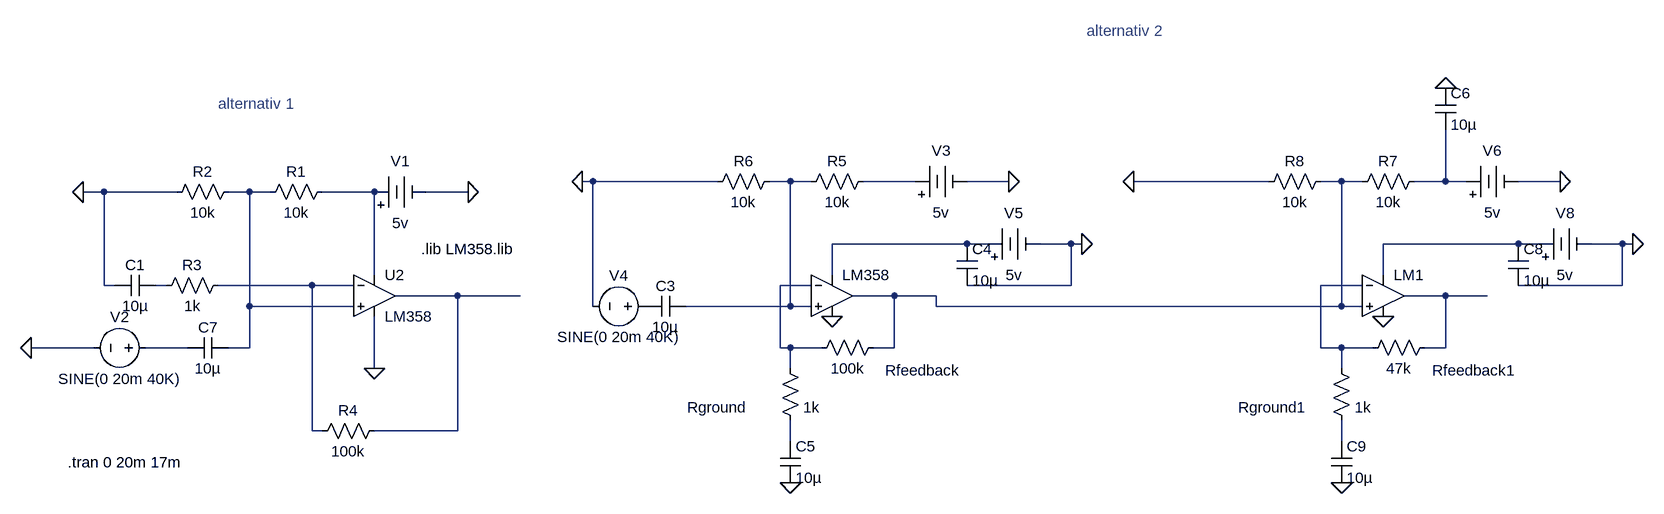
[diagram p0: schematic vilopunkt_LM358.asc]
vilopunkt_LM358.asc, the LTspice schematic file:
Version 4
SHEET 1 2372 680
WIRE 752 -288 736 -288
WIRE 944 -288 752 -288
WIRE 1056 -288 1024 -288
WIRE 1088 -288 1056 -288
WIRE 1248 -288 1168 -288
WIRE 1392 -288 1328 -288
WIRE 1792 -288 1584 -288
WIRE 1904 -288 1872 -288
WIRE 1936 -288 1904 -288
WIRE 2064 -288 2064 -368
WIRE 2064 -288 2016 -288
WIRE 2096 -288 2064 -288
WIRE 2240 -288 2176 -288
WIRE 0 -272 -32 -272
WIRE 112 -272 0 -272
WIRE 224 -272 192 -272
WIRE 256 -272 224 -272
WIRE 416 -272 336 -272
WIRE 560 -272 496 -272
WIRE 1328 -192 1120 -192
WIRE 1360 -192 1328 -192
WIRE 1488 -192 1440 -192
WIRE 1504 -192 1488 -192
WIRE 2176 -192 1968 -192
WIRE 2208 -192 2176 -192
WIRE 2336 -192 2288 -192
WIRE 2352 -192 2336 -192
WIRE 416 -144 416 -272
WIRE 1120 -144 1120 -192
WIRE 1968 -144 1968 -192
WIRE 0 -128 0 -272
WIRE 16 -128 0 -128
WIRE 96 -128 80 -128
WIRE 320 -128 176 -128
WIRE 384 -128 320 -128
WIRE 1088 -128 1040 -128
WIRE 1488 -128 1488 -192
WIRE 1488 -128 1328 -128
WIRE 1936 -128 1872 -128
WIRE 2336 -128 2336 -192
WIRE 2336 -128 2176 -128
WIRE 544 -112 448 -112
WIRE 640 -112 544 -112
WIRE 1216 -112 1152 -112
WIRE 1280 -112 1216 -112
WIRE 2064 -112 2000 -112
WIRE 2128 -112 2064 -112
WIRE 224 -96 224 -272
WIRE 384 -96 224 -96
WIRE 752 -96 752 -288
WIRE 1056 -96 1056 -288
WIRE 1056 -96 896 -96
WIRE 1088 -96 1056 -96
WIRE 1280 -96 1280 -112
WIRE 1904 -96 1904 -288
WIRE 1904 -96 1280 -96
WIRE 1936 -96 1904 -96
WIRE -16 -32 -112 -32
WIRE 128 -32 64 -32
WIRE 224 -32 224 -96
WIRE 224 -32 192 -32
WIRE 1040 -32 1040 -128
WIRE 1056 -32 1040 -32
WIRE 1104 -32 1056 -32
WIRE 1216 -32 1216 -112
WIRE 1216 -32 1184 -32
WIRE 1872 -32 1872 -128
WIRE 1904 -32 1872 -32
WIRE 1952 -32 1904 -32
WIRE 2064 -32 2064 -112
WIRE 2064 -32 2032 -32
WIRE 416 0 416 -80
WIRE 1056 0 1056 -32
WIRE 1904 0 1904 -32
WIRE 320 96 320 -128
WIRE 336 96 320 96
WIRE 544 96 544 -112
WIRE 544 96 416 96
WIRE 1056 112 1056 80
WIRE 1904 112 1904 80
FLAG 560 -272 0
FLAG 416 0 0
FLAG -32 -272 0
FLAG 1392 -288 0
FLAG 736 -288 0
FLAG 1504 -192 0
FLAG 1056 176 0
FLAG 2240 -288 0
FLAG 1584 -288 0
FLAG 2064 -432 0
FLAG 2352 -192 0
FLAG 1904 176 0
FLAG 1120 -80 0
FLAG 1968 -80 0
FLAG -112 -32 0
SYMBOL Misc\\battery 400 -272 R270
WINDOW 0 32 56 VTop 2
WINDOW 3 -32 56 VBottom 2
WINDOW 123 0 0 Left 0
WINDOW 39 0 0 Left 0
SYMATTR InstName V1
SYMATTR Value 5v
SYMBOL OpAmps\\opamp2 416 -176 R0
SYMATTR InstName U2
SYMATTR Value LM358
SYMBOL res 352 -288 R90
WINDOW 0 0 56 VBottom 2
WINDOW 3 32 56 VTop 2
SYMATTR InstName R1
SYMATTR Value 10k
SYMBOL res 96 -256 R270
WINDOW 0 32 56 VTop 2
WINDOW 3 0 56 VBottom 2
SYMATTR InstName R2
SYMATTR Value 10k
SYMBOL res 192 -144 R90
WINDOW 0 0 56 VBottom 2
WINDOW 3 32 56 VTop 2
SYMATTR InstName R3
SYMATTR Value 1k
SYMBOL cap 80 -144 R90
WINDOW 0 0 32 VBottom 2
WINDOW 3 32 32 VTop 2
SYMATTR InstName C1
SYMATTR Value 10µ
SYMBOL res 432 80 R90
WINDOW 0 0 56 VBottom 2
WINDOW 3 32 56 VTop 2
SYMATTR InstName R4
SYMATTR Value 100k
SYMBOL voltage 80 -32 R90
WINDOW 0 -32 56 VBottom 2
WINDOW 3 32 56 VTop 2
WINDOW 123 0 0 Left 0
WINDOW 39 0 0 Left 0
SYMATTR InstName V2
SYMATTR Value SINE(0 20m 40K)
SYMBOL OpAmps\\UniversalOpAmp2 1120 -112 R0
SYMATTR InstName LM358
SYMBOL res 1184 -304 R90
WINDOW 0 0 56 VBottom 2
WINDOW 3 32 56 VTop 2
SYMATTR InstName R5
SYMATTR Value 10k
SYMBOL res 928 -272 R270
WINDOW 0 32 56 VTop 2
WINDOW 3 0 56 VBottom 2
SYMATTR InstName R6
SYMATTR Value 10k
SYMBOL Misc\\battery 1232 -288 R270
WINDOW 0 32 56 VTop 2
WINDOW 3 -32 56 VBottom 2
WINDOW 123 0 0 Left 0
WINDOW 39 0 0 Left 0
SYMATTR InstName V3
SYMATTR Value 5v
SYMBOL voltage 848 -96 R90
WINDOW 0 -32 56 VBottom 2
WINDOW 3 32 56 VTop 2
WINDOW 123 0 0 Left 0
WINDOW 39 0 0 Left 0
SYMATTR InstName V4
SYMATTR Value SINE(0 20m 40K)
SYMBOL cap 896 -112 R90
WINDOW 0 0 32 VBottom 2
WINDOW 3 32 32 VTop 2
SYMATTR InstName C3
SYMATTR Value 10µ
SYMBOL Misc\\battery 1344 -192 R270
WINDOW 0 32 56 VTop 2
WINDOW 3 -32 56 VBottom 2
WINDOW 123 0 0 Left 0
WINDOW 39 0 0 Left 0
SYMATTR InstName V5
SYMATTR Value 5v
SYMBOL cap 1312 -192 R0
SYMATTR InstName C4
SYMATTR Value 10µ
SYMBOL res 1200 -48 R90
WINDOW 0 66 -60 VBottom 2
WINDOW 3 32 56 VTop 2
SYMATTR InstName Rfeedback
SYMATTR Value 100k
SYMBOL res 1040 -16 R0
WINDOW 0 -143 76 Left 2
SYMATTR InstName Rground
SYMATTR Value 1k
SYMBOL cap 1040 112 R0
SYMATTR InstName C5
SYMATTR Value 10µ
SYMBOL OpAmps\\UniversalOpAmp2 1968 -112 R0
SYMATTR InstName LM1
SYMBOL res 2032 -304 R90
WINDOW 0 0 56 VBottom 2
WINDOW 3 32 56 VTop 2
SYMATTR InstName R7
SYMATTR Value 10k
SYMBOL res 1776 -272 R270
WINDOW 0 32 56 VTop 2
WINDOW 3 0 56 VBottom 2
SYMATTR InstName R8
SYMATTR Value 10k
SYMBOL Misc\\battery 2080 -288 R270
WINDOW 0 32 56 VTop 2
WINDOW 3 -32 56 VBottom 2
WINDOW 123 0 0 Left 0
WINDOW 39 0 0 Left 0
SYMATTR InstName V6
SYMATTR Value 5v
SYMBOL cap 2048 -432 R0
SYMATTR InstName C6
SYMATTR Value 10µ
SYMBOL Misc\\battery 2192 -192 R270
WINDOW 0 32 56 VTop 2
WINDOW 3 -32 56 VBottom 2
WINDOW 123 0 0 Left 0
WINDOW 39 0 0 Left 0
SYMATTR InstName V8
SYMATTR Value 5v
SYMBOL cap 2160 -192 R0
SYMATTR InstName C8
SYMATTR Value 10µ
SYMBOL res 2048 -48 R90
WINDOW 0 66 -60 VBottom 2
WINDOW 3 32 56 VTop 2
SYMATTR InstName Rfeedback1
SYMATTR Value 47k
SYMBOL res 1888 -16 R0
WINDOW 0 -143 76 Left 2
SYMATTR InstName Rground1
SYMATTR Value 1k
SYMBOL cap 1888 112 R0
SYMATTR InstName C9
SYMATTR Value 10µ
SYMBOL cap 192 -48 R90
WINDOW 0 0 32 VBottom 2
WINDOW 3 32 32 VTop 2
SYMATTR InstName C7
SYMATTR Value 10µ
TEXT 488 -184 Left 2 !.lib LM358.lib
TEXT -56 144 Left 2 !.tran 0 20m 17m
TEXT 176 -408 Left 2 ;alternativ 1
TEXT 1512 -520 Left 2 ;alternativ 2

The netlist it stands for:
* vilopunkt_LM358.asc
V1 N006 0 5v
XU2 N005 N010 N006 0 N013 LM358  ; pins In+ In- V+ V- OUT
R1 N006 N005 10k
R2 0 N005 10k
R3 N010 N009 1k
C1 N009 0 10µ
R4 N013 N010 100k
V2 N015 0 SINE(0 20m 40K)
XLM358 N001 N011 N007 0 N003 level2 Avol=1Meg GBW=10Meg Slew=10Meg Ilimit=25m Rail=0 Vos=0 En=0 Enk=0 In=0 Ink=0 Rin=500Meg  ; pins In+ In- V+ V- OUT
R5 N002 N001 10k
R6 0 N001 10k
V3 N002 0 5v
V4 P001 0 SINE(0 20m 40K)
C3 N001 P001 10µ
V5 N007 0 5v
C4 N007 0 10µ
Rfeedback N003 N011 100k
Rground N011 N016 1k
C5 N016 0 10µ
XLM1 N003 N012 N008 0 N014 level2 Avol=1Meg GBW=10Meg Slew=10Meg Ilimit=25m Rail=0 Vos=0 En=0 Enk=0 In=0 Ink=0 Rin=500Meg  ; pins In+ In- V+ V- OUT
R7 N004 N003 10k
R8 0 N003 10k
V6 N004 0 5v
C6 0 N004 10µ
V8 N008 0 5v
C8 N008 0 10µ
Rfeedback1 N014 N012 47k
Rground1 N012 N017 1k
C9 N017 0 10µ
C7 N005 N015 10µ
.lib LM358.lib
.tran 0 20m 17m
* alternativ 1
* alternativ 2
.lib UniversalOpAmp2.lib
.backanno
.end